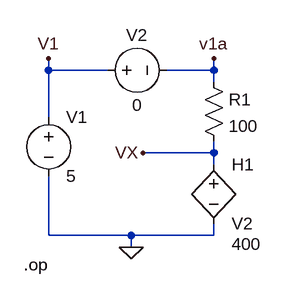
[diagram p0: schematic ccvs1.asc]
ccvs1.asc, the LTspice schematic file:
Version 4
SHEET 1 880 680
WIRE -48 48 -48 32
WIRE 32 48 -48 48
WIRE 176 48 176 32
WIRE 176 48 112 48
WIRE 176 64 176 48
WIRE -48 112 -48 48
WIRE 176 160 176 144
WIRE 176 160 80 160
WIRE 176 176 176 160
WIRE -48 272 -48 192
WIRE 64 272 -48 272
WIRE 176 272 176 256
WIRE 176 272 64 272
WIRE 64 288 64 272
FLAG 64 288 0
FLAG -48 32 V1
FLAG 80 160 VX
FLAG 176 32 v1a
SYMBOL res 160 48 R0
SYMATTR InstName R1
SYMATTR Value 100
SYMBOL h 176 160 R0
WINDOW 123 24 124 Left 2
SYMATTR InstName H1
SYMATTR Value V2
SYMATTR Value2 400
SYMBOL voltage -48 96 R0
WINDOW 123 0 0 Left 0
WINDOW 39 0 0 Left 0
SYMATTR InstName V1
SYMATTR Value 5
SYMBOL voltage 16 48 R270
WINDOW 0 32 56 VTop 2
WINDOW 3 -32 56 VBottom 2
WINDOW 123 0 0 Left 0
WINDOW 39 0 0 Left 0
SYMATTR InstName V2
SYMATTR Value 0
TEXT -82 312 Left 2 !.op

The netlist it stands for:
* ccvs1.asc
R1 v1a VX 100
H1 VX 0 V2 400
V1 V1 0 5
V2 V1 v1a 0
.op
.backanno
.end